# EAGLE design Adafruit DRV2605L (EAGLE 6.3)
AUTHOR: KTOWN
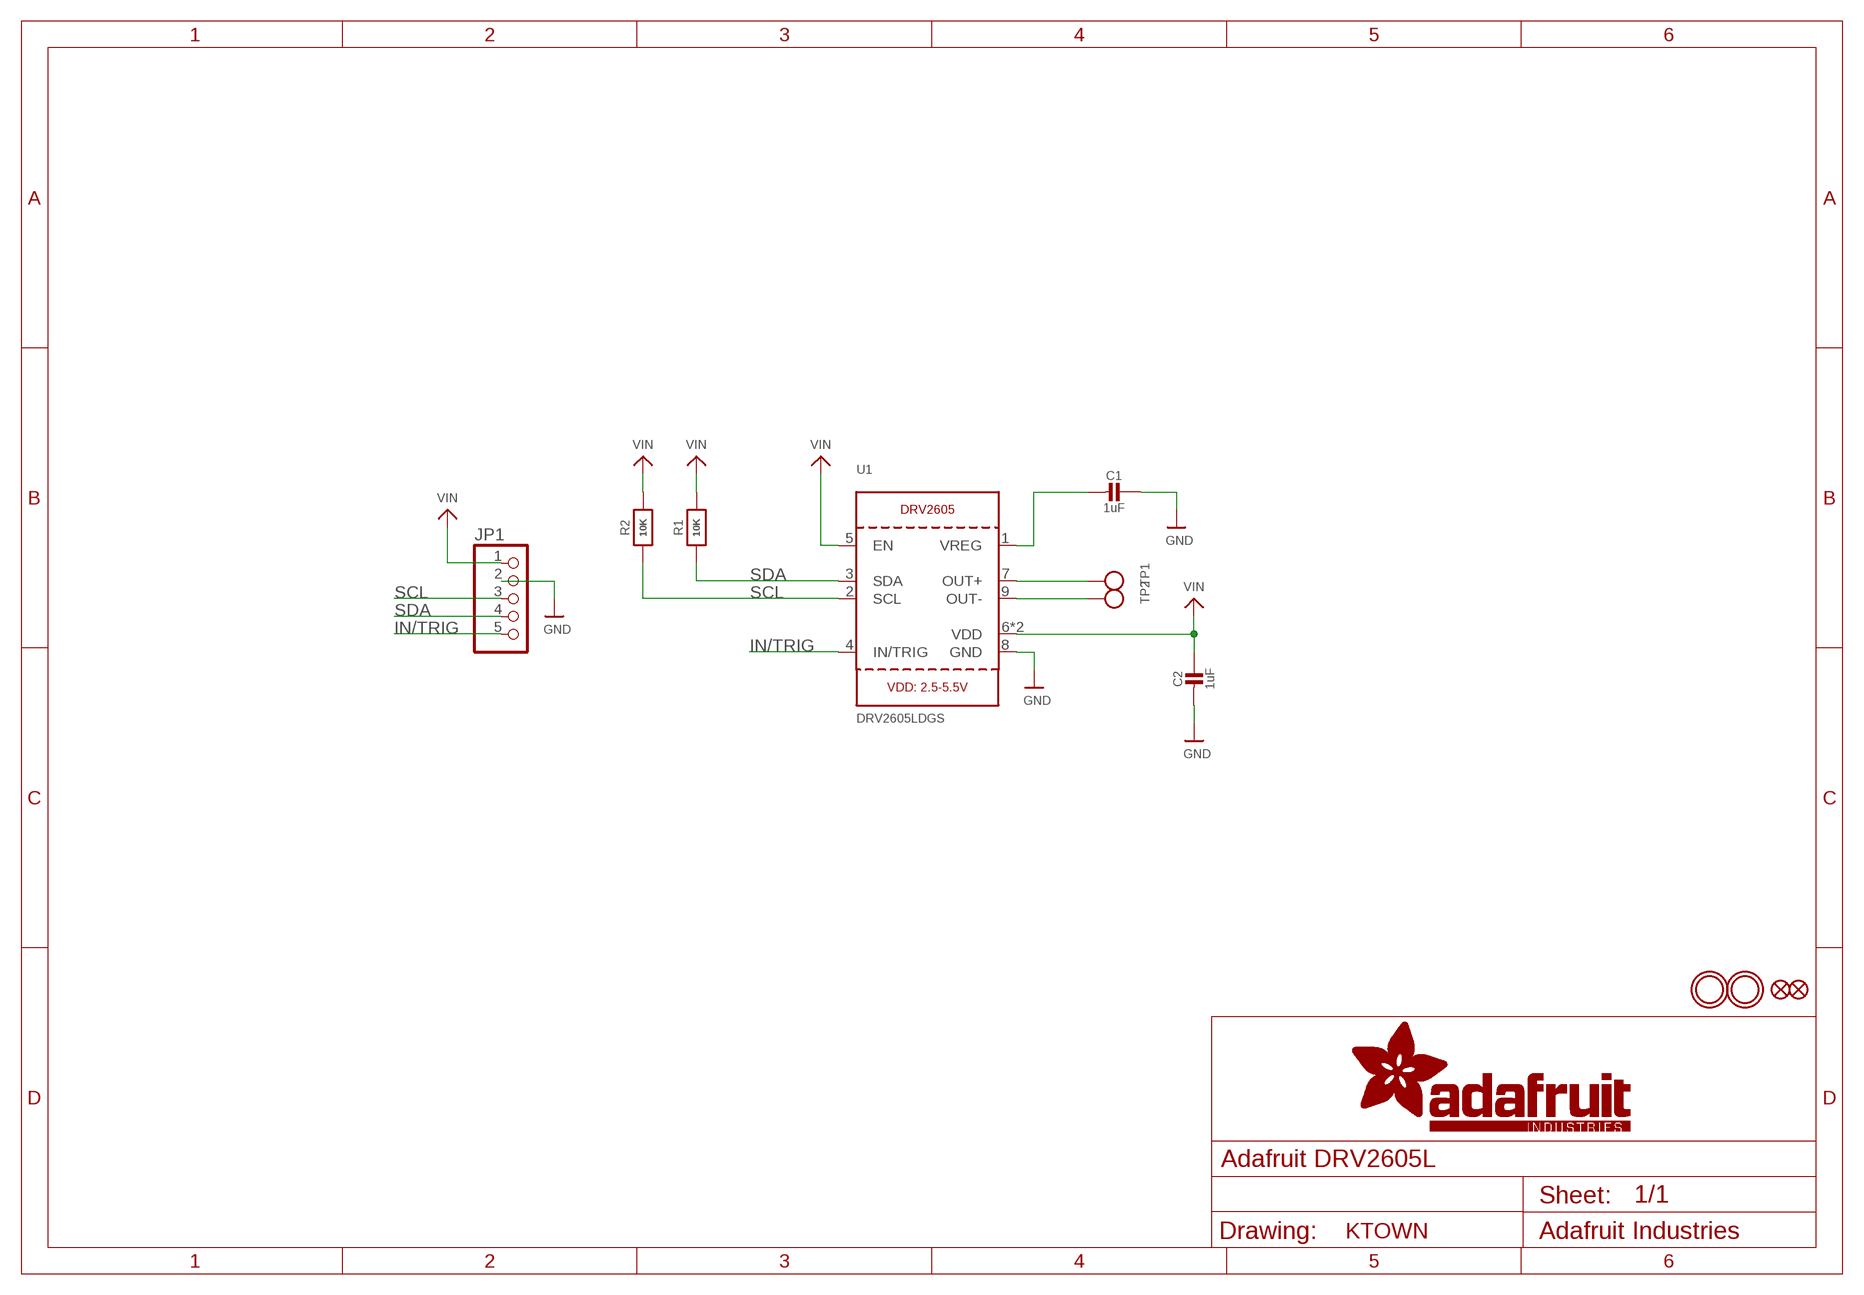
[diagram p0: schematic, sheet 1]

## Parts
C1  1uF  CAP_CERAMIC0805-NOOUTLINE  [0805-NO]
C2  1uF  CAP_CERAMIC0805-NOOUTLINE  [0805-NO]
FID1  FIDUCIAL""  [FIDUCIAL_1MM]
FID2  FIDUCIAL""  [FIDUCIAL_1MM]
JP1  HEADER-1X576MIL_FULL  [1X05_ROUND_FULL_76]
R1  10K  RESISTOR0805_NOOUTLINE  [0805-NO]
R2  10K  RESISTOR0805_NOOUTLINE  [0805-NO]
TP1  TESTPOINTPAD2MM  [TESTPOINT_PAD_2MM]
TP2  TESTPOINTPAD2MM  [TESTPOINT_PAD_2MM]
U1  DRV2605LDGS  DRV2605_SOP  [PSOP10]
U$2  MOUNTINGHOLE2.5  [MOUNTINGHOLE_2.5_PLATED]
U$3  MOUNTINGHOLE2.5  [MOUNTINGHOLE_2.5_PLATED]

## Nets
GND: C1.1 C2.2 JP1.2 U1.8(GND)
IN/TRIG: JP1.5 U1.4(IN/TRIG)
N$5: C1.2 U1.1(VREG)
OUT+: TP1.P$1 U1.7(OUT+)
OUT-: TP2.P$1 U1.9(OUT-)
SCL: JP1.3 R2.1 U1.2(SCL)
SDA: JP1.4 R1.1 U1.3(SDA)
VIN: C2.1 JP1.1 R1.2 R2.2 U1.5(EN) U1.6(VDD) U1.10(VDD)

## Library data of the parts
C1 C2 = microbuilder:CAP_CERAMIC: Ceramic Capacitors For new designs, use the packages preceded by an '_' character since they are more reliable: The following footprints should be used on most boards: _0402 - Standard footprint for regular board layouts _0603 - Standard footprint for regular board layouts _0805 - Standard footprint for regular board layouts _1206 - Standard footprint for regular board layouts For extremely tight-pitch boards where space is at a premium, the following 'micro-pitch' footprints can be used (smaller pads, no silkscreen outline, etc.): _0402MP - Micro-pitch footprint for very dense/compact boards _0603MP - Micro-pitch footprint for very dense/compact boards _0805MP - Micro-pitch footprint for very dense/compact boards _1206MP - Micro-pitch footprint for very dense/compact boards
FID1 FID2 = microbuilder:FIDUCIAL: Fiducial Alignment Points Various fiducial points for machine vision alignment.; BOM: EXCLUDE
JP1 = microbuilder:HEADER-1X5: PIN HEADER
R1 R2 = microbuilder:RESISTOR: Resistors For new designs, use the packages preceded by an '_' character since they are more reliable: The following footprints should be used on most boards: _0402 - Standard footprint for regular board layouts _0603 - Standard footprint for regular board layouts _0805 - Standard footprint for regular board layouts _1206 - Standard footprint for regular board layouts For extremely tight-pitch boards where space is at a premium, the following 'micro-pitch' footprints can be used (smaller pads, no silkscreen outline, etc.): _0402MP - Micro-pitch footprint for very dense/compact boards _0603MP - Micro-pitch footprint for very dense/compact boards _0805MP - Micro-pitch footprint for very dense/compact boards _1206MP - Micro-pitch footprint for very dense/compact boards
TP1 TP2 = microbuilder:TESTPOINT: Test Point Various test points for characterisation and PCB testing TESTPOINT_SMT - Compact Surface Mount Test Point [Digikey: 5016KTR-ND]
U1 = microbuilder:DRV2605: DRV2605 - Haptic Driver for ERM/LRA Motors
U$2 U$3 = microbuilder:MOUNTINGHOLE: Mounting Hole For #2 screws (0.086"/2.18mm width, 0.094"/2.4mm hole) use 2.5mm; BOM: EXCLUDE

## Board
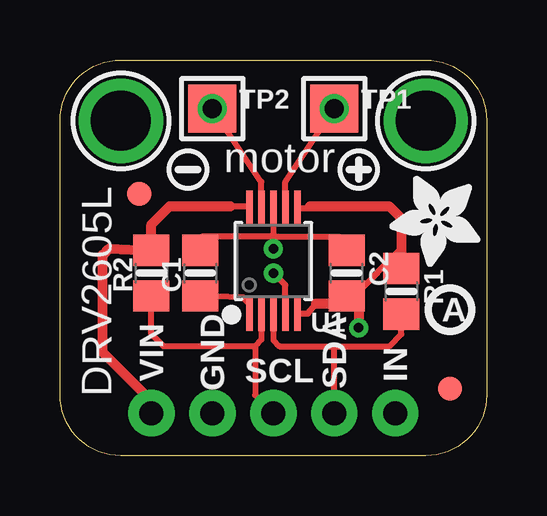
[diagram p1: board, top side]
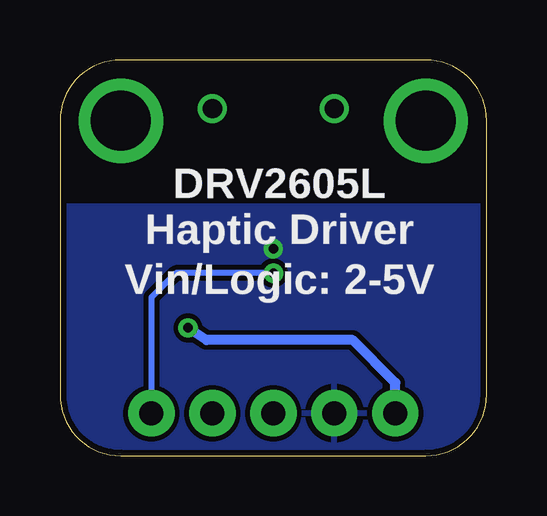
[diagram p2: board, bottom side, seen from below]

Size 17.78 x 16.51 mm. Coordinates in mm from the lower left corner, seen from the top.
Outline: 0,2.54 0,13.97 arc-90 2.54,16.51 15.24,16.51 arc-90 17.78,13.97 17.78,2.54 arc-90 15.24,0 2.54,0 arc-90 0,2.54
Copper layers (1*16): Top 0.035mm / dielectric 1.5mm / Bottom 0.035mm
Design rules "adafruit": minimum track width 8mil, minimum drill 15.5mil, track to track 8mil, track to pad 8mil, pad to pad 8mil, via to via 8mil, smd to smd 8mil, copper to edge 10mil, drill to drill 8mil, minimum pad ring 10mil, minimum via ring 8mil, stop-mask expansion 2mil, vias tented up to drill 20mil, thermal gap 10mil

### Footprints (pad centres in the part's own frame; a part is rotated, then mirrored left to right if it is on the bottom)
0805-NO = smd 1.3 x 1.5: 1 -0.95,0; 2 0.95,0
FIDUCIAL_1MM = smd 1 x 1: 1 0,0
1X05_ROUND_FULL_76 = drill 1 pad 1.93: 1 -5.08,0; 2 -2.54,0; 3 0,0; 4 2.54,0; 5 5.08,0
TESTPOINT_PAD_2MM = smd 2 x 2: P$1 0,0
PSOP10 = smd 0.28 x 1.45: 1 -1,-2.2; 2 -0.5,-2.2; 3 0,-2.2; 4 0.5,-2.2; 5 1,-2.2; 6 1,2.2; 7 0.5,2.2; 8 0,2.2; 9 -0.5,2.2; 10 -1,2.2
MOUNTINGHOLE_2.5_PLATED = drill 2.5 pad 3.2: P$1 0,0

### Placement (x,y rotation side)
C1  5.84,7.62 270 top
C2  11.94,7.62 90 top
FID1  16.26,2.79 0 top
FID2  3.3,10.92 0 top
JP1  8.89,1.78 0 top
R1  14.22,6.86 90 top
R2  3.81,7.62 90 top
TP1  11.43,14.48 0 top
TP2  6.35,14.48 0 top
U1  8.89,8.13 0 top
U$2  2.54,13.97 0 top
U$3  15.24,13.97 0 top
U$4  [SYMBOL_PLUS]  12.45,11.94 90 top
U$5  [SYMBOL_MINUS]  5.33,11.94 0 top
U$15  [PCBFEAT-REV-040]  16.26,6.1 0 top
U$18  [ADAFRUIT_3.5MM]  17.53,11.68 180 top

### Tracks (layer width: path | path; a pad name or v marks a point on that pad's centre or on a via)
GND  (via drill 0.39)
  Top 0.254: U1.8 v8.89,8.64 8.89,9.14 | 8.89,9.14 5.91,9.14 C1.1 | 8.89,9.14 11.62,9.14 C2.2
  pour Bottom: 0,10.41 0,0.25 18.03,0.25 18.03,10.41
IN/TRIG  (via drill 0.4)
  Top 0.254: U1.4 9.39,7.12 v8.89,7.62
  Bottom 0.254: v8.89,7.62 12.95,7.62 13.97,6.6 JP1.5
N$5
  Top 0.254: U1.1 7.89,6.33 7.62,6.6 C1.2
OUT+  (via drill 0.8)
  Top 0.254: 9.39,10.13 U1.7 9.39,11.42 TP1.P$1
  other vias: 11.43,14.48
OUT-  (via drill 0.8)
  Top 0.254: 8.39,10.23 U1.9 8.39,11.42 TP2.P$1
  other vias: 6.35,14.48
SCL
  Top 0.254: U1.2 8.39,4.83 8.13,4.57 | 8.13,4.57 4.32,4.57 3.81,5.08 R2.1 | 8.13,4.57 8.13,2.54 JP1.3
SDA
  Top 0.254: U1.3 8.89,4.83 9.14,4.57 11.43,4.57 | 11.43,4.57 13.72,4.57 14.22,5.08 R1.1 | JP1.4 11.43,4.57
VIN  (via drill 0.39)
  Top 0.254: 7.11,10.41 7.8,10.41 U1.10 | U1.6 10.33,10.33 10.41,10.41 | U1.5 10.33,5.93 10.67,6.35 | R1.2 14.29,8.64 14.22,8.64 12.26,6.67 C2.1
  Top 0.406: 12.45,6.35 12.45,6.42 | JP1.1 3.81,2.29 1.78,4.32 1.78,8.38 2.03,8.64 R2.2 3.81,9.65 4.57,10.41 7.11,10.41 | 10.41,10.41 13.72,10.41 14.22,9.91 14.22,8.64 R1.2 | C2.1 11.68,7.11 12.45,6.35 | 10.67,6.35 12.45,6.35 | 12.45,6.35 v12.45,5.33
  Bottom 0.406: JP1.1 3.81,3.05 5.59,4.83 11.68,4.83 v12.45,5.33

### Text on the board
tPlace: motor | DRV2605L | VIN | GND | SCL | SDA | IN
bPlace: DRV2605L / Haptic Driver | Vin/Logic: 2-5V